# Altium schematic sheet Sheet4.SchDoc
size A4; SheetNumber: 3; SheetTotal: 4
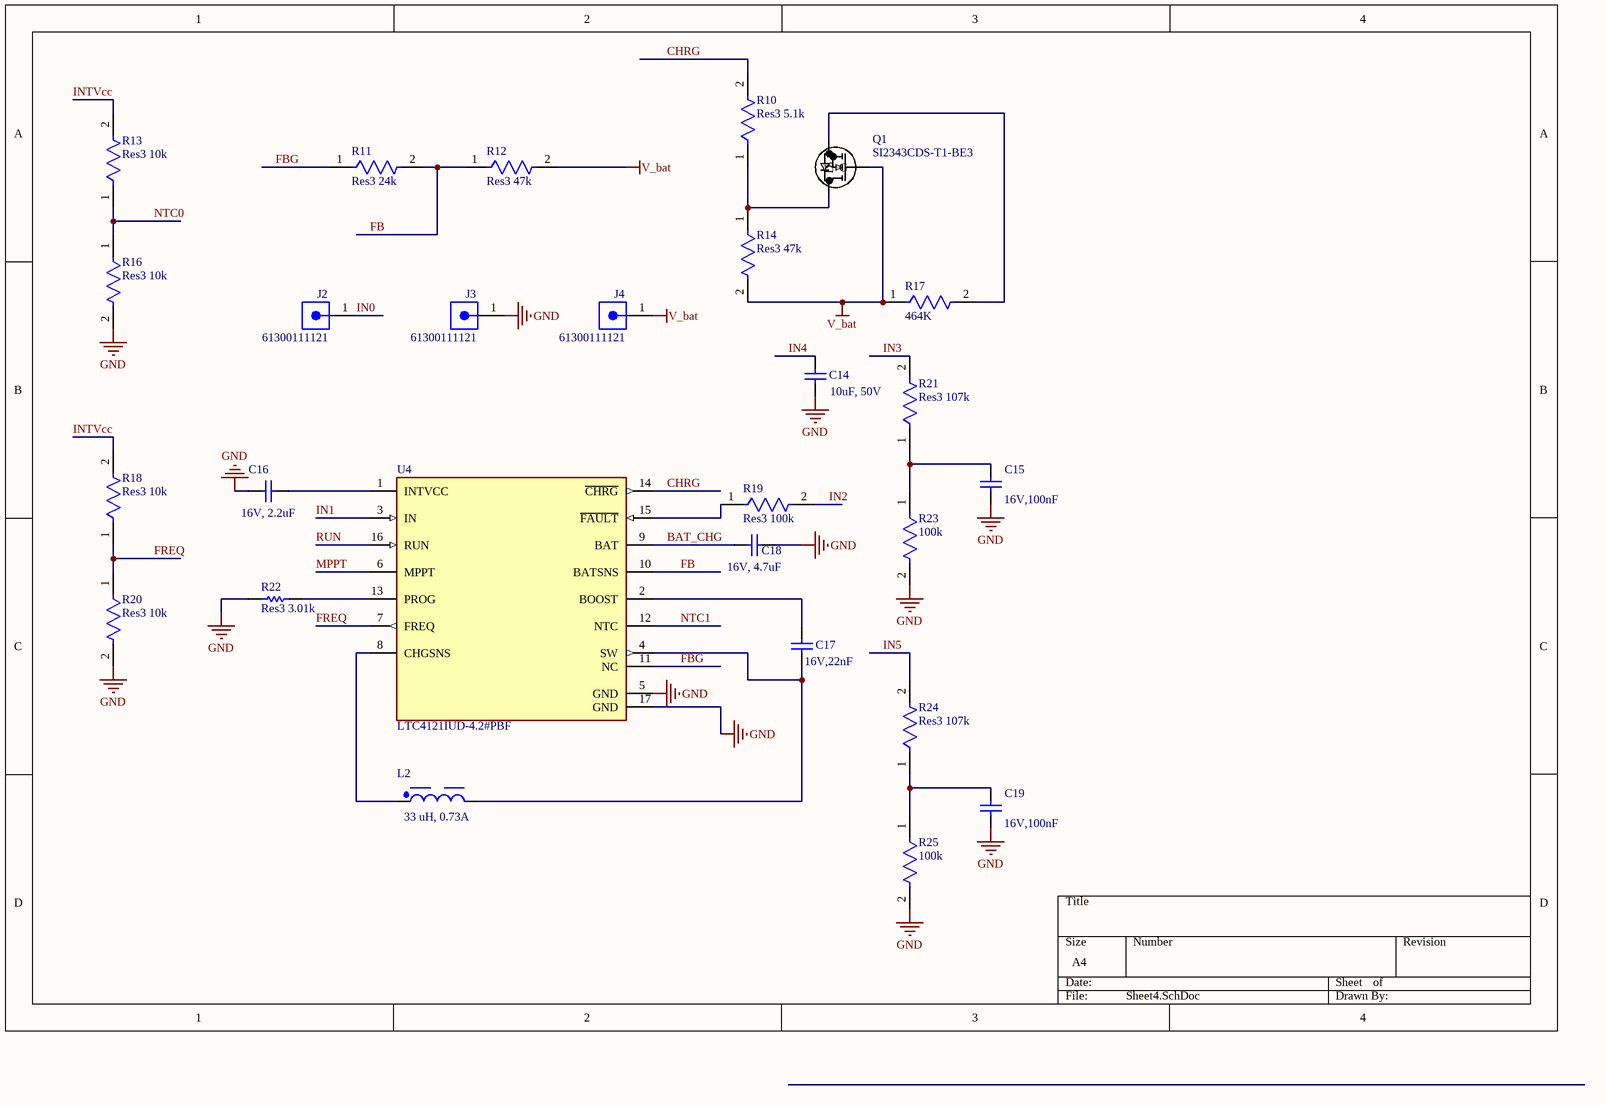
[diagram p0: Sheet4.SchDoc]

## Parts
C14  10uF, 50V  [WCAP-CSGP_1206_L3.2W1.6H1.6]
C15  16V,100nF  [WCAP-CSGP_0603_L1.6W0.8H0.8_Reflow]
C16  16V, 2.2uF  [WCAP-CSGP_0603_L1.6W0.8H0.8_Reflow]
C17  16V,22nF  [WCAP-CSGP_0603_L1.6W0.8H0.8_Reflow]
C18  16V, 4.7uF  [WCAP-CSGP_0805_L2W1.25H1.25]
C19  16V,100nF  [WCAP-CSGP_0603_L1.6W0.8H0.8_Reflow]
J2  61300111121  [61300111121]
J3  61300111121  [61300111121]
J4  61300111121  [61300111121]
L2  33 uH, 0.73A  [WE-TPC_4818]
Q1  SI2343CDS-T1-BE3  [SOT-23_TO-236_VIS]
R10  Res3 5.1k  [FP-RMCF0603-IPC_A]
R11  Res3 24k  [FP-CRCW0603-e3-IPC_B]
R12  Res3 47k  [FP-CRGCQ0603-IPC_C]
R13  Res3 10k  [FP-SG73P1J-MFG]
R14  Res3 47k  [FP-CRGCQ0603-IPC_C]
R16  Res3 10k  [FP-SG73P1J-MFG]
R17  464K  [FP-CRCW0603-HPe3-IPC_C]
R18  Res3 10k  [FP-SG73P1J-MFG]
R19  Res3 100k  [FP-CRGP0603-IPC_C]
R20  Res3 10k  [FP-SG73P1J-MFG]
R21  Res3 107k  [FP-CPF0603-MFG]
R22  Res3 3.01k  [RESC1608X55X30ML20T10]
R23  100k  [FP-CRGP0603-IPC_C]
R24  Res3 107k  [FP-CPF0603-MFG]
R25  100k  [FP-CRGP0603-IPC_C]
U4  LTC4121IUD-4.2#PBF  [FP-UD-16-05-08-1691-IPC_B]

## Nets
GND: C14.1 C15.2 C16.1 C18.2 C19.2 J3.1 R16.2 R20.2 R22.1 R23.2 R25.2 U4.5(GND) U4.17(GND)
V_bat: J4.1 Q1.1(G) R12.2 R14.2 R17.1
BAT_CHG: C18.1 U4.9(BAT)
CHRG: R10.2 U4.14(~{CHRG})
FB: R11.2 R12.1 U4.10(BATSNS)
FBG: R11.1 U4.11(NC)
FREQ: R18.1 R20.1 U4.7(FREQ)
IN0: J2.1
IN1: U4.3(IN)
IN2: R19.2
IN3: R21.2
IN4: C14.2
IN5: R24.2
INTVcc: R13.2 R18.2
MPPT: U4.6(MPPT)
NTC0: R13.1 R16.1
NTC1: U4.12(NTC)
RUN: U4.16(RUN)
NetC15_1: C15.1 R21.1 R23.1
NetC16_2: C16.2 U4.1(INTVCC)
NetC17_1: C17.1 L2.2 U4.4(SW)
NetC17_2: C17.2 U4.2(BOOST)
NetC19_1: C19.1 R24.1 R25.1
NetL2_1: L2.1 U4.8(CHGSNS)
NetQ1_2: Q1.2(S) R17.2
NetQ1_3: Q1.3(D) R10.1 R14.1
NetR19_1: R19.1 U4.15(~{FAULT})
NetR22_2: R22.2 U4.13(PROG)

## Library data of the parts
C14 = CMP-03913-104794498-2: Cap, 10Uf, 50V, Mlcc, 1206 Rohs Compliant: Yes; Insulation Resistance: 5MΩ; Capacitance: 10µF; Min Operating Temperature: -55°C; Length: 3.2mm; Width: 1.6mm; RoHS: Compliant; Max Operating Temperature: 85°C; Height: 1.6mm; Voltage Rating: 50V
C15 C19 = CMP-03913-53914755-2: Cap Ceramic 0.1uF 16V X7R 10% Pad SMD 0603 125C T/R; Insulation Resistance: 5GΩ; Case/Package: 0603; Mount: Surface Mount; Voltage Rating (DC): 16V; Thickness: 863.6µm; RoHS: Compliant; Case Code (Metric): 1608; Tolerance: 10%; Capacitance: 100nF; Length: 1.6mm; Case Code (Imperial): 0603; Height: 800µm; Min Operating Temperature: -55°C; Voltage Rating: 16V; Width: 800µm; Max Operating Temperature: 125°C; REACH SVHC: Unknown; Dielectric: X7R
C16 = CMP-03913-53914723-2: Cap Ceramic 2.2uF 16V X5R 20% Pad SMD 0603 85C T/R; Capacitance: 2.2µF; Insulation Resistance: 50MΩ; Case/Package: 0603; Case Code (Metric): 1608; Length: 1.6mm; Tolerance: 20%; Max Operating Temperature: 85°C; RoHS: Compliant; Thickness: 990.6µm; Voltage Rating: 16V; Width: 800µm; Height: 800µm; Voltage Rating (DC): 16V; Min Operating Temperature: -55°C; REACH SVHC: Unknown; Dielectric: X5R; Mount: Surface Mount; Case Code (Imperial): 0603
C17 = CMP-03913-53914751-2: Cap Ceramic 0.022uF 16V X7R 10% Pad SMD 0603 125C T/R; Insulation Resistance: 10GΩ; Min Operating Temperature: -55°C; Thickness: 863.6µm; Max Operating Temperature: 125°C; Length: 1.6mm; Mount: Surface Mount; Dielectric: X7R; Case/Package: 0603; RoHS: Compliant; Packaging: Tape & Reel (TR); Width: 800µm; Height: 800µm; Tolerance: 10%; Case Code (Imperial): 0603; Voltage Rating: 16V; Case Code (Metric): 1608; Voltage Rating (DC): 16V; Capacitance: 22nF
C18 = CMP-03913-65419738-2: Multilayer Ceramic Capacitor 4.7uF 0805; Capacitance: 4.7µF; Tolerance: 20%; Insulation Resistance: 20MΩ; Dielectric: X5R; Case/Package: 0805; Max Operating Temperature: 85°C; Case Code (Imperial): 0805; Packaging: Cut Tape; Height: 1.25mm; Width: 1.25mm; Voltage Rating: 16V; Min Operating Temperature: -55°C; Thickness: 1.4478mm; RoHS: Compliant; Length: 2mm; Case Code (Metric): 2012; Voltage Rating (DC): 16V; Mount: Surface Mount
J2-J4 = CMP-1502-01058-4: THT Vertical Pin Header WR-PHD, Pitch 2.54 mm, Single Row, 1 pins; Gender: Male; Contact Resistance: 20mΩ; Current Rating: 3A; Number of Contacts: 1; Connector Type: Male Pin; Operating Supply Voltage: 250V; Termination: Solder; Mount: Through Hole; Orientation: Vertical; Contact Material: Copper; Number of Positions: 1; Color: Black; Packaging: Bulk; Contact Plating: Gold; Number of Pins: 1; Contact Mating Length: 5.9944mm; RoHS: Compliant; Number of Rows: 1; Lead Pitch: 2.54mm
L2 = CMP-0227-00363-4: WE-TPC SMT Shielded Tiny Power Inductor; Inductance Tolerance: 30%; Current Rating: 720mA; DC Resistance (DCR): 382mΩ; Self Resonant Frequency: 21MHz; Inductance: 33µH; Ambient Temperature Range High: 95°C; Min Operating Temperature: -40°C; RoHS: Compliant; Ambient Temperature Range Low: -40°C; Height: 1.8mm; Max Operating Temperature: 125°C; Length: 4.8mm; Width: 4.8mm; Number of Pins: 2
Q1 = SI2343CDS-T1-BE3: P-CHANNEL 30-V (D-S) MOSFET; Manufacturer_Name: Vishay; Copyright: Copyright (C) 2026 Ultra Librarian. All rights reserved.; Manufacturer_Part_Number: SI2343CDS-T1-BE3
R10 = CMP-26527-001717-1: 5.1kΩ ±5% 0.1W 0603 Thick Film Chip Resistor AEC-Q200 compliant; Resistance: 5.1kR; Max Power Dissipation: 100mW; Temperature Coefficient: 200ppm/°C; Height: 0.022inch; Number of Terminations: 2; Features: Automotive AEC-Q200; Resistor Type: Thick Film; Length: 0.061inch; Min Operating Temperature: -55°C; Packaging: Tape and Reel; Max Operating Temperature: 155°C; Tolerance: 5%; Package Quantity: 1; Series: RMCF; Contact Plating: Tin; Width: 0.031inch; Mount: Surface Mount; RoHS Compliant: Yes; Case/Package: 0603; Case Code (Metric): 1608; Case Code (Imperial): 0603; Radiation Hardening: No
R11 = CMP-02407-010366-1: RES Thick Film, 24kΩ, 1%, 0.1W, 100ppm/°C, 0603; Max Power Dissipation: 100mW; Resistance: 24kR; Number of Terminations: 2; Tolerance: 1%; Features: Automotive AEC-Q200; Lead Free: Lead Free; Length: 0.061inch; Case/Package: 0603; Package Quantity: 20000; Max Operating Temperature: 155°C; Packaging: Tape and Reel; Min Operating Temperature: -55°C; Width: 0.033inch; Temperature Coefficient: 100ppm/°C; Height: 0.02inch; Composition: Thick Film
R12 R14 = CMP-03211-009389-1: CRGCQ 0603 47K 1%; Manufacturer: TE Connectivity; Manufacturer Part Number: CRGCQ0603F47K; Voltage Rating: 75V; Power Rating: 0.1W; Tolerance: 0.01; Temperature Coefficient: ±100ppm/°C; Value: 47KΩ; Series: CRGCQ; Device Class L3: Chip SMD Resistors; ComponentLink2Description: Datasheet; Ipc Land Pattern Name: RESC16080X45; Ambient Temperature Range High: +70°C; Package: CRGCQ0603; Height: 0.55mm; Lead Free: Yes; ComponentLink2URL: https://www.te.com/commerce/DocumentDelivery/DDEController?Action=showdoc&DocId=Data+Sheet%7F1773204-3%7F1%7Fpdf%7FEnglish%7FENG_DS_1773204-3_1.pdf%7F4-2176339-1074; Temperature Range Low: -55°C; Octopart: https://octopart.com/crgcq0603f47k-te+connectivity-91018077; RoHS: TRUE; Temperature: -55°C to +155°C; Temperature Range High: +155°C; Digikey Description: CRGCQ 0603 47K 1%; Device Class L1: Passive Components; Composition: Thick Film; Mouser Description: Res Thick Film 0603 47K Ohm 1% 0.1W(1/10W) ±100ppm/C Pad SMD Automotive T/R; Resistance: 47KΩ; Device Class L2: Resistors; Category: Res
R13 R16 R18 R20 = CMP-00683-07748074-1: SG73P1JTTD1002F Res Thick Film 0603 10K Ohm 1% 0.2W(1/5W) ±100ppm/C Pad SMD Automotive T/R; Temperature Coefficient: 100ppm/°C; Power Rating: 200mW; Voltage Rating (DC): 50V; Resistance: 10kΩ; Case/Package: 0603; RoHS: Compliant; Termination: SMD/SMT; Case Code (Metric): 1608; Min Operating Temperature: -55°C; Voltage Rating: 50V; NexarPartId: 7748074; Tolerance: 1%; Case Code (Imperial): 0603; Max Operating Temperature: 155°C; Number of Pins: 2
R17 = CMP-02407-008915-1: RES Thick Film, 464kΩ, 1%, 0.33W, 100ppm/°C, 0603; Resistance: 464kR; Max Power Dissipation: 250mW; Number of Terminations: 2; Package Quantity: 5000; Case/Package: 0603; Composition: Thick Film; Temperature Coefficient: 100ppm/°C; Min Operating Temperature: -55°C; Tolerance: 1%; Width: 0.033inch; Length: 0.063inch; Max Operating Temperature: 155°C; Lead Free: Lead Free; Height: 0.022inch; Packaging: Tape and Reel; Features: Automotive AEC-Q200
R19 R23 R25 = CMP-03211-000885-1: CRGP 0603 100K 1%; Manufacturer: TE; Manufacturer Part Number: CRGP0603F100K; Power Rating: 0.25W; Resistance: 100KΩ; Voltage Rating: 50V; Value: 100KΩ; Tolerance: 0.01; Temperature Coefficient: ±100ppm/°C; Device Class L2: Resistors; Temperature: -55°C to +155°C; Temperature Range High: +155°C; Ambient Temperature Range High: +70°C; Lead Free: Yes; RoHS: TRUE; Octopart: https://octopart.com/crgp0603f100k-te+connectivity-91018719; Digikey Description: CRGP 0603 100K 1%; Automotive: No; ComponentLink2Description: Datasheet; Category: Res; Ipc Land Pattern Name: RESC16080X45; Device Class L3: Chip SMD Resistors; Composition: Thick Film; Temperature Range Low: -55°C; Height: 0.55mm; Device Class L1: Passive Components; Series: CRGP; Package: CRGP0603; ComponentLink2URL: https://www.te.com/commerce/DocumentDelivery/DDEController?Action=srchrtrv&DocNm=9-1773463-9&DocType=DS&DocLang=English
R21 R24 = CMP-03211-010099-1: RES SMD 107KΩ 0.1% 1/16W 0603; Manufacturer Part Number: CPF0603B107KE1; Manufacturer: TE Connectivity; Temperature Coefficient: 25ppm/°C; Voltage Rating: 50V; Power Rating: 0.063W; octopart_url: https://octopart.com/cpf0603b107ke1-te+connectivity-22739702; Resistance: 107KΩ; Device Class L2: Resistors; ComponentLink2URL: https://www.te.com/commerce/DocumentDelivery/DDEController?Action=showdoc&DocId=Data+Sheet%7F1773200%7FM%7Fpdf%7FEnglish%7FENG_DS_1773200_M.pdf%7F3-1676481-2; Device Class L1: Passive Components; Package: CPF0603; packaging: 1k Reel; Series: CPF; Automotive: No; Value: 107KΩ; Ipc Land Pattern Name: RESC15580X45; Composition: Thin Film; Temperature Range Low: -55°C; Octopart: https://octopart.com/cpf0603b107ke1-te+connectivity-22739702; ComponentLink2Description: Datasheet; RoHS: TRUE; Height: 0.55mm; Tolerance: 0.1%; Category: Res; Temperature: -55°C to +155°C; Temperature Range High: +155°C; Device Class L3: Chip SMD Resistors; Lead Free: Yes
R22 = CMP-2000-01402-1: Manufacturer: KOA Speer; Part Number: RK73H1JTTD3011F
U4 = CMP-09132-000034-1: IC BATT CHG LI-ION 16QFN; Max Charge Current: 400mA; Max Supply Voltage: 40V; Battery Pack Voltage: 4.2V; Packaging: Rail/Tube; RoHS Compliant: Yes; Case/Package: QFN; Max Operating Temperature: 125°C; Min Operating Temperature: -40°C